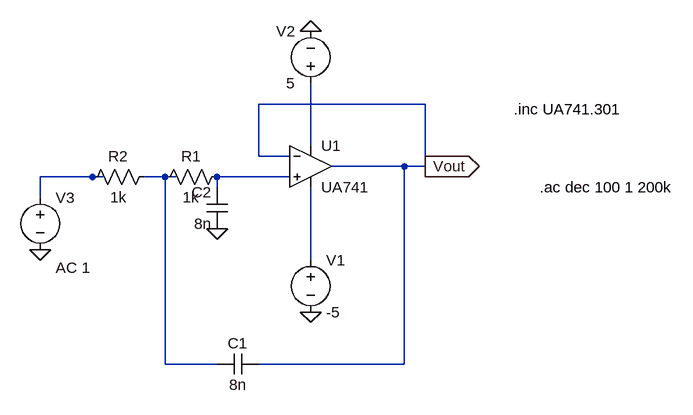
[diagram p0: schematic LP_Sallen_Key_20khz.asc]
LP_Sallen_Key_20khz.asc, the LTspice schematic file:
Version 4.1
SHEET 1 880 680
WIRE 384 48 128 48
WIRE 208 112 208 16
WIRE 128 128 128 48
WIRE 176 128 128 128
WIRE 352 144 240 144
WIRE 384 144 384 48
WIRE 384 144 352 144
WIRE -128 160 -208 160
WIRE -112 160 -128 160
WIRE -16 160 -48 160
WIRE 0 160 -16 160
WIRE 176 160 64 160
WIRE 64 176 64 160
WIRE -208 192 -208 160
WIRE 208 288 208 176
WIRE -16 448 -16 160
WIRE 64 448 -16 448
WIRE 352 448 352 144
WIRE 352 448 128 448
FLAG 208 -64 0
FLAG 208 368 0
FLAG 64 240 0
FLAG -208 272 0
FLAG 384 144 Vout
IOPIN 384 144 Out
SYMBOL OpAmps\\opamp2 208 80 R0
SYMATTR InstName U1
SYMATTR Value UA741
SYMBOL voltage 208 32 R180
WINDOW 0 24 96 Left 2
WINDOW 3 24 16 Left 2
WINDOW 123 0 0 Left 0
WINDOW 39 0 0 Left 0
SYMATTR InstName V2
SYMATTR Value 5
SYMBOL voltage -208 176 R0
WINDOW 123 24 124 Left 2
WINDOW 39 0 0 Left 0
SYMATTR Value2 AC 1
SYMATTR InstName V3
SYMATTR Value ""
SYMBOL voltage 208 272 R0
WINDOW 123 0 0 Left 0
WINDOW 39 0 0 Left 0
SYMATTR InstName V1
SYMATTR Value -5
SYMBOL cap 128 432 R90
WINDOW 0 0 32 VBottom 2
WINDOW 3 32 32 VTop 2
SYMATTR InstName C1
SYMATTR Value 8n
SYMBOL cap 80 240 R180
WINDOW 0 24 56 Left 2
WINDOW 3 24 8 Left 2
SYMATTR InstName C2
SYMATTR Value 8n
SYMBOL res 80 144 R90
WINDOW 0 0 56 VBottom 2
WINDOW 3 32 56 VTop 2
SYMATTR InstName R1
SYMATTR Value 1k
SYMBOL res -32 144 R90
WINDOW 0 0 56 VBottom 2
WINDOW 3 32 56 VTop 2
SYMATTR InstName R2
SYMATTR Value 1k
TEXT 520 56 Left 2 !.inc UA741.301
TEXT 560 176 Left 2 !.ac dec 100 1 200k

The netlist it stands for:
* LP_Sallen_Key_20khz.asc
X§U1 N004 Vout N001 N005 Vout UA741  ; pins In+ In- V+ V- OUT
V2 N001 0 5
V3 N002 0 AC 1
V1 N005 0 -5
C1 Vout N003 8n
C2 0 N004 8n
R1 N004 N003 1k
R2 N003 N002 1k
.inc UA741.301
.ac dec 100 1 200k
.backanno
.end